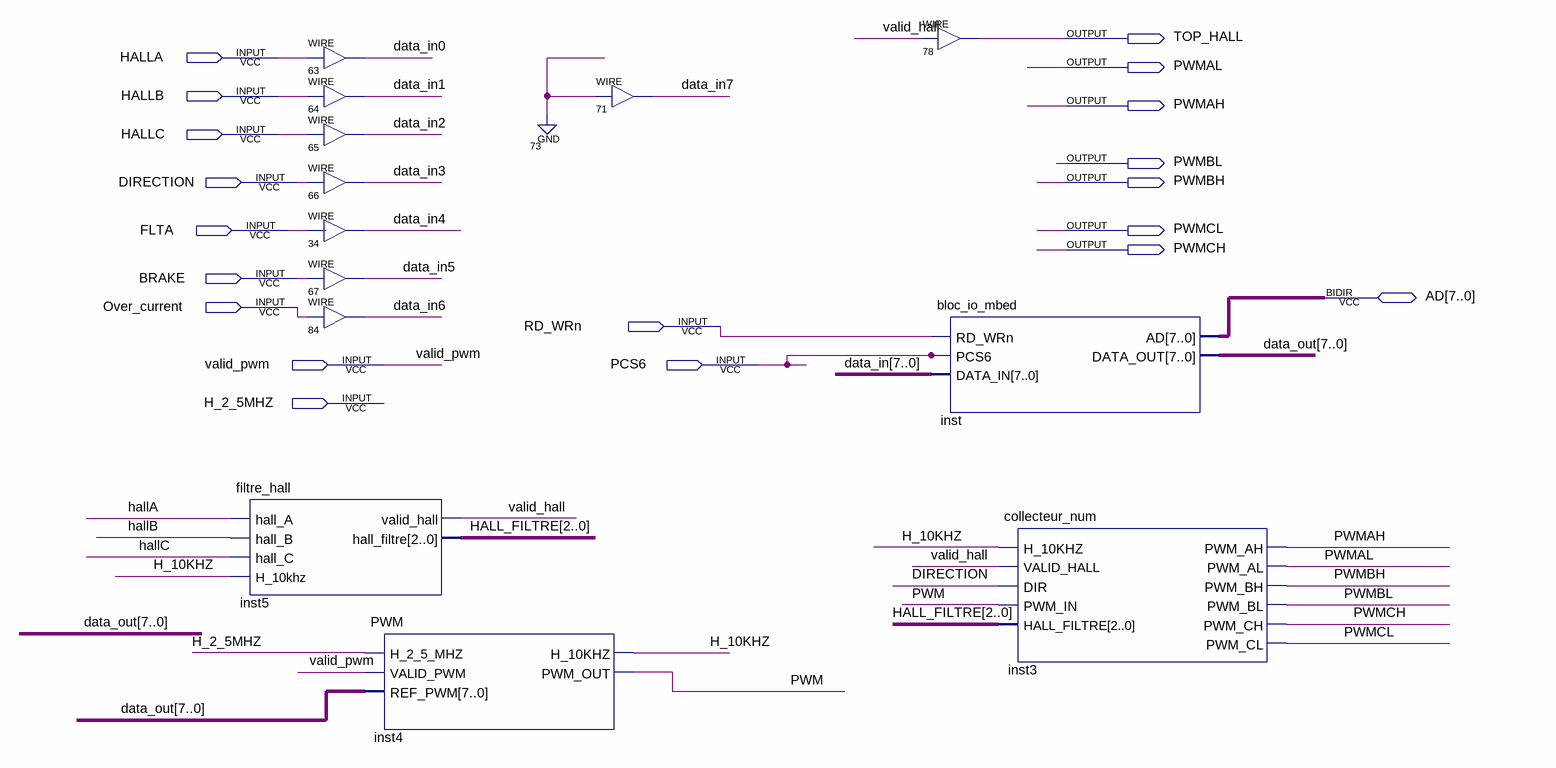
[diagram p0: schematic sheet]
// Quartus schematic matrix_scooter_pwm_mbed_etudiant_mbed.bdf as structural Verilog: 13 symbols, 19 pins
module matrix_scooter_pwm_mbed_etudiant_mbed (
  input  HALLA,
  input  HALLB,
  input  HALLC,
  input  DIRECTION,
  input  FLTA,
  input  BRAKE,
  input  Over_current,
  input  RD_WRn,
  input  valid_pwm,
  input  PCS6,
  input  H_2_5MHZ,
  inout  [7:0] AD,
  output TOP_HALL,
  output PWMAL,
  output PWMAH,
  output PWMBL,
  output PWMBH,
  output PWMCL,
  output PWMCH
);

  wire H_10KHZ, PWM, valid_hall;
  wire [2:0] HALL_FILTRE;
  wire [7:0] data_in, data_out;

  filtre_hall inst5 (
    .hall_A(HALLA), .hall_B(HALLB), .hall_C(HALLC), .H_10khz(H_10KHZ), .valid_hall(valid_hall),
    .hall_filtre(HALL_FILTRE));
  assign data_in[0] = HALLA;  // WIRE 63
  assign data_in[1] = HALLB;  // WIRE 64
  assign data_in[2] = HALLC;  // WIRE 65
  assign data_in[3] = DIRECTION;  // WIRE 66
  assign data_in[4] = FLTA;  // WIRE 34
  assign data_in[5] = BRAKE;  // WIRE 67
  assign data_in[6] = Over_current;  // WIRE 84
  PWM inst4 (.H_2_5_MHZ(H_2_5MHZ), .VALID_PWM(valid_pwm), .REF_PWM(data_out), .H_10KHZ(H_10KHZ), .PWM_OUT(PWM));
  assign data_in[7] = 1'b0;  // WIRE 71
  assign TOP_HALL = valid_hall;  // WIRE 78
  bloc_io_mbed inst (.RD_WRn(RD_WRn), .PCS6(PCS6), .DATA_IN(data_in), .DATA_OUT(data_out), .AD(AD));
  collecteur_num inst3 (
    .H_10KHZ(H_10KHZ), .VALID_HALL(valid_hall), .DIR(DIRECTION), .PWM_IN(PWM), .HALL_FILTRE(HALL_FILTRE),
    .PWM_AH(PWMAH), .PWM_AL(PWMAL), .PWM_BH(PWMBH), .PWM_BL(PWMBL), .PWM_CH(PWMCH), .PWM_CL(PWMCL));
endmodule
